# EAGLE design FXIMU (EAGLE 7.7.0)
COMPANY: ADAFRUIT INDUSTRIES; DRAWN: KTOWN; REV: A

## Sheet 1 of 2
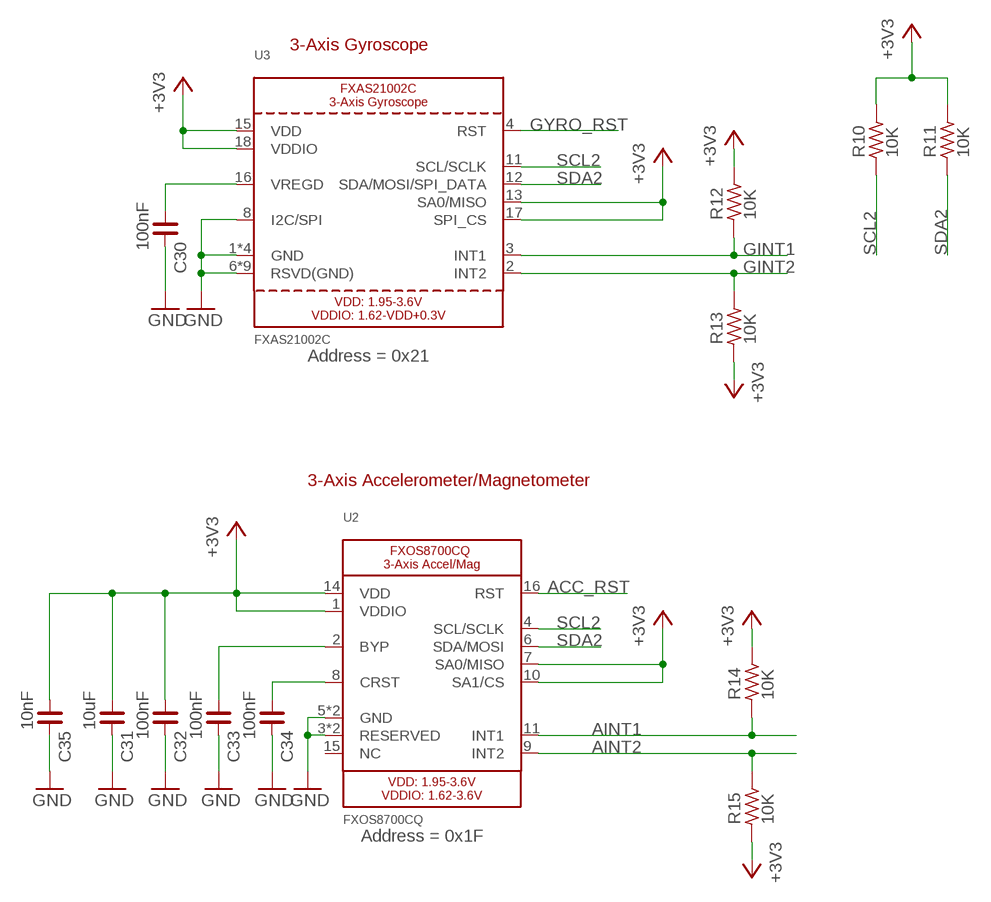
[diagram p0: schematic, sheet 1]

### Parts
C30  100nF  C_0402  [C0402]
C31  10uF  C_0603  [C0603]
C32  100nF  C_0402  [C0402]
C33  100nF  C_0402  [C0402]
C34  100nF  C_0402  [C0402]
C35  10nF  C_0402  [C0402]
R10  10K  R_0402  [R0402]
R11  10K  R_0402  [R0402]
R12  10K  R_0402  [R0402]
R13  10K  R_0402  [R0402]
R14  10K  R_0402  [R0402]
R15  10K  R_0402  [R0402]
U2  FXOS8700CQ  ACCEL_MAG_FXOS8700CQ  [QFN16_3MM_FREESCALE_5X3]
U3  FXAS21002C  GYRO_FXAS21002C  [QFN24_4MM_FREESCALE_7X5]

### Nets
+3V3: C31.1 C32.1 C35.1 R10.2 R11.2 R12.2 R13.1 R14.2 R15.1 U2.1(VDDIO) U2.7(SA0/MISO) U2.10(SA1/CS) U2.14(VDD) U3.13(SA0/MISO) U3.15(VDD) U3.17(SPI_CS) U3.18(VDDIO) ; also sheet 2
ACC_RST: U2.16(RST) ; also sheet 2
AINT1: R14.1 U2.11(INT1) ; also sheet 2
AINT2: R15.2 U2.9(INT2) ; also sheet 2
GINT1: R12.1 U3.3(INT1) ; also sheet 2
GINT2: R13.2 U3.2(INT2) ; also sheet 2
GND: C30.2 C31.2 C32.2 C33.2 C34.2 C35.2 U2.3(RESERVED) U2.5(GND) U2.12(GND) U2.13(RESERVED) U3.1(GND) U3.5(GND) U3.6(RSVD(GND)) U3.7(RSVD(GND)) U3.8(I2C/SPI) U3.9(RSVD(GND)) U3.10(RSVD(GND)) U3.14(GND) U3.19(GND) U3.20(RSVD(GND)) U3.21(RSVD(GND)) U3.22(RSVD(GND)) U3.23(RSVD(GND)) U3.24(RSVD(GND)) ; also sheet 2
GYRO_RST: U3.4(RST) ; also sheet 2
N$1: C30.1 U3.16(VREGD)
N$24: C33.1 U2.2(BYP)
N$26: C34.1 U2.8(CRST)
SCL2: R10.1 U2.4(SCL/SCLK) U3.11(SCL/SCLK) ; also sheet 2
SDA2: R11.1 U2.6(SDA/MOSI) U3.12(SDA/MOSI/SPI_DATA) ; also sheet 2
Unconnected: U2.15(NC)

### Notes on the sheet
- 3-Axis Gyroscope
- Address = 0x21
- 3-Axis Accelerometer/Magnetometer
- Address = 0x1F

## Sheet 2 of 2
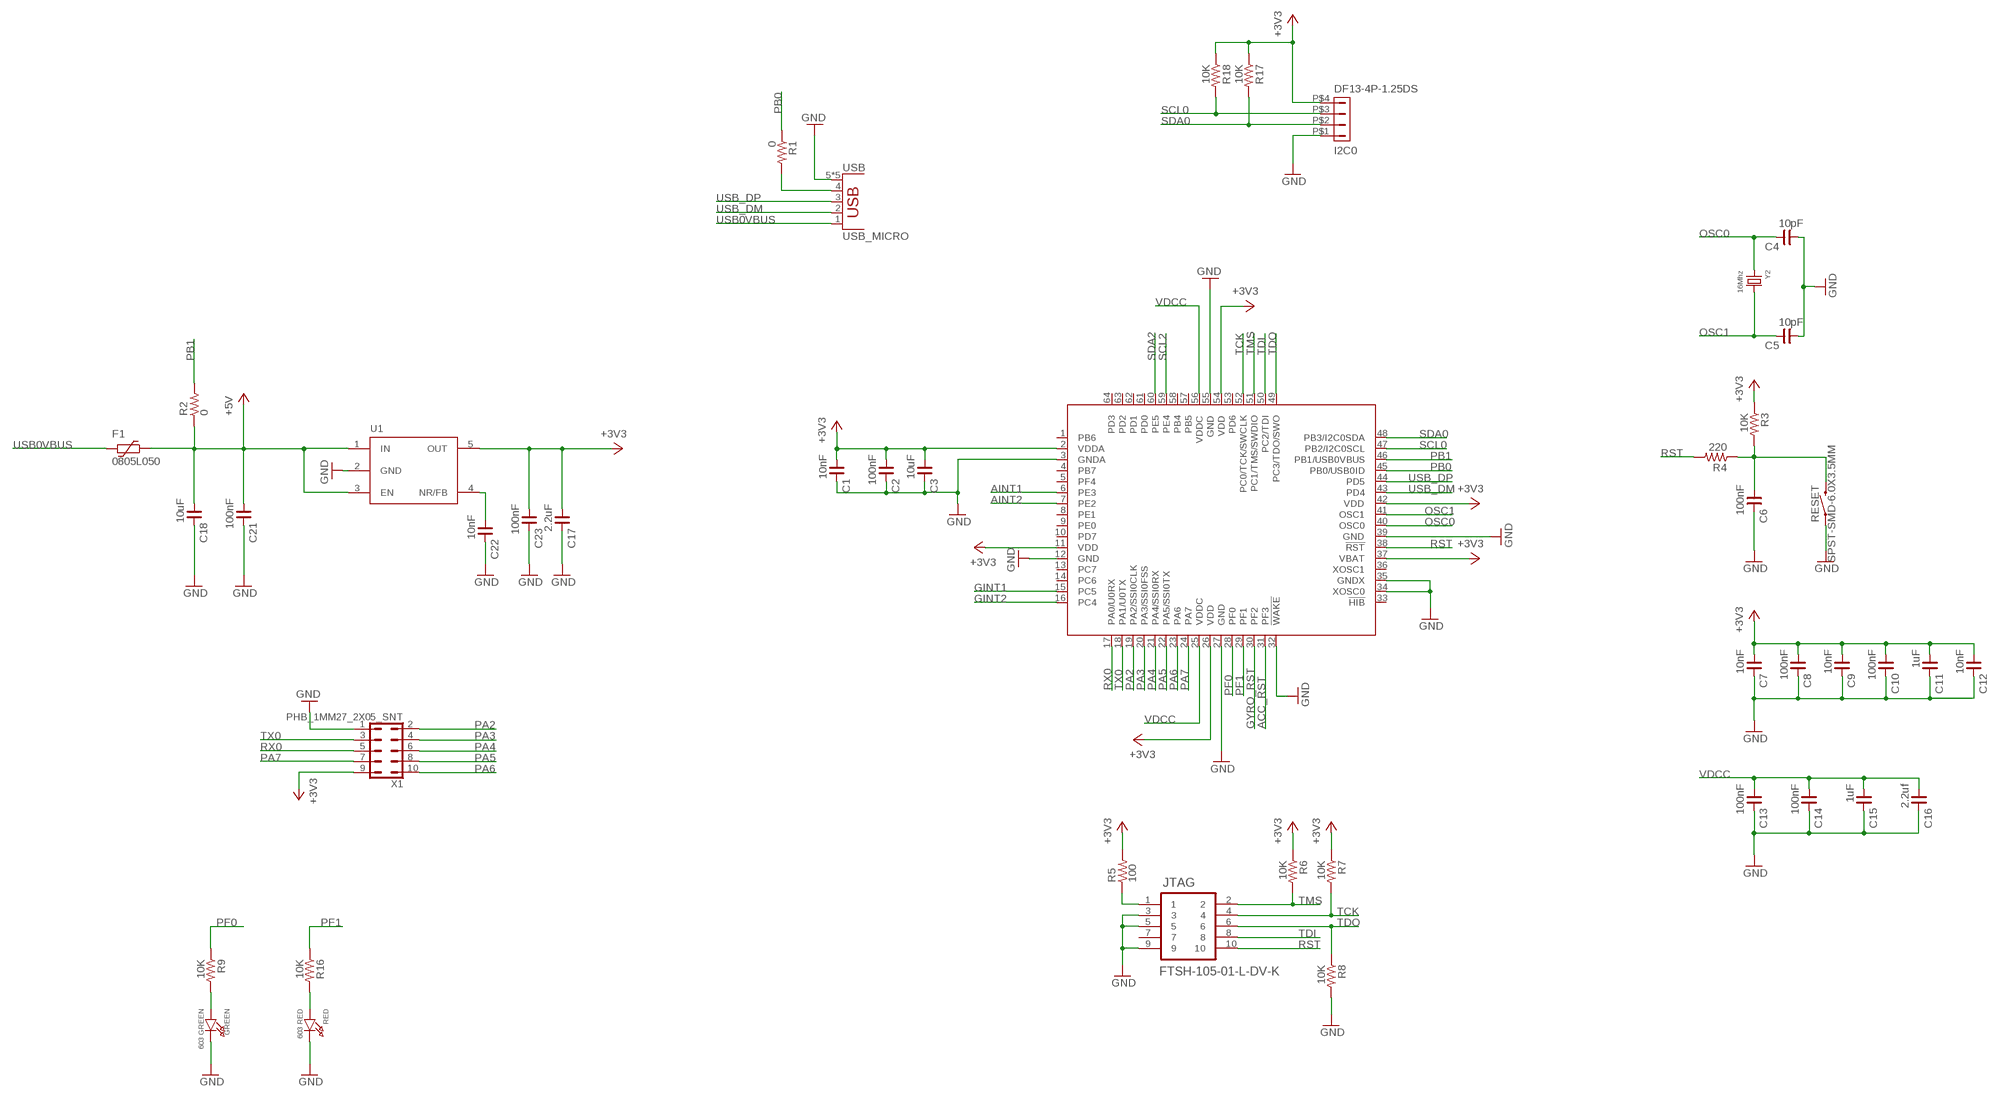
[diagram p1: schematic, sheet 2]

### Parts
C1  10nF  C_0402  [C0402]
C2  100nF  C_0402  [C0402]
C3  10uF  C_0603  [C0603]
C4  10pF  C_0402  [C0402]
C5  10pF  C_0402  [C0402]
C6  100nF  C_0402  [C0402]
C7  10nF  C_0402  [C0402]
C8  100nF  C_0402  [C0402]
C9  10nF  C_0402  [C0402]
C10  100nF  C_0402  [C0402]
C11  1uF  C_0402  [C0402]
C12  10nF  C_0402  [C0402]
C13  100nF  C_0402  [C0402]
C14  100nF  C_0402  [C0402]
C15  1uF  C_0402  [C0402]
C16  2.2uf  C_0603  [C0603]
C17  2.2uF  C_0603  [C0603]
C18  10uF  C_0603  [C0603]
C21  100nF  C_0402  [C0402]
C22  10nF  C_0402  [C0402]
C23  100nF  C_0402  [C0402]
F1  0805L050  [0805L]
GREEN  603 GREEN  LED0603  [CHIPLED_0603]
I2C0  DF13-4P-1.25DS  [DF13-4P-1.25DS]
IC1  TM4C123[7,G]XXPM  [PM_S-PQFP-G64]
JTAG  FTSH-105-01-L-DV-K  [SAMTEC_FTSH-105-01-L-DV-K]
R1  0  R_0402  [R0402]
R2  0  R_0402  [R0402]
R3  10K  R_0402  [R0402]
R4  220  R_0402  [R0402]
R5  100  R_0402  [R0402]
R6  10K  R_0402  [R0402]
R7  10K  R_0402  [R0402]
R8  10K  R_0402  [R0402]
R9  10K  R_0402  [R0402]
R16  10K  R_0402  [R0402]
R17  10K  R_0402  [R0402]
R18  10K  R_0402  [R0402]
RED  603 RED  LED0603  [CHIPLED_0603]
RESET  SPST-SMD-6.0X3.5MM  MOMENTARY-SWITCH-SPST-SMD-6.0X3.5MM  [TACTILE_SWITCH_SMD_6.0X3.5MM]
U1  TPS73633  [SOT23-5L]
USB  USB_MICRO  [USB_MICRO_MOLEX_FULL]
X1  PHB_1MM27_2X05_SNT  [PHB_1MM27_2X05_SNT]
Y2  16Mhz  CRYSTAL.6X3.3MM  [6X3.3MM]

### Nets
+3V3: C1.1 C2.1 C3.1 C7.1 C8.1 C9.1 C10.1 C11.1 C12.1 C17.1 C23.1 I2C0.P$4 IC1.2(VDDA) IC1.11(VDD) IC1.26(VDD) IC1.37(VBAT) IC1.42(VDD) IC1.54(VDD) R3.1 R5.2 R6.1 R7.1 R17.1 R18.1 U1.5(OUT) X1.9 ; also sheet 1
+5V: C18.1 C21.1 F1.1 R2.1 U1.1(IN) U1.3(EN)
ACC_RST: IC1.31(PF3) ; also sheet 1
AINT1: IC1.6(PE3) ; also sheet 1
AINT2: IC1.7(PE2) ; also sheet 1
GINT1: IC1.15(PC5) ; also sheet 1
GINT2: IC1.16(PC4) ; also sheet 1
GND: C1.2 C2.2 C3.2 C4.1 C5.1 C6.2 C7.2 C8.2 C9.2 C10.2 C11.2 C12.2 C13.2 C14.2 C15.2 C16.2 C17.2 C18.2 C21.2 C22.2 C23.2 GREEN.C I2C0.P$1 IC1.3(GNDA) IC1.12(GND) IC1.27(GND) IC1.32(!WAKE) IC1.34(XOSC0) IC1.35(GNDX) IC1.39(GND) IC1.55(GND) JTAG.3 JTAG.5 JTAG.9 R8.2 RED.C RESET.1 U1.2(GND) USB.5(GND) USB.P$1(GND) USB.P$2(GND) USB.P$3(GND) USB.P$4(GND) X1.1 ; also sheet 1
GYRO_RST: IC1.30(PF2) ; also sheet 1
N$2: JTAG.1 R5.1
N$4: C6.1 R3.2 R4.1 RESET.2
N$7: GREEN.A R9.2
N$8: R1.2 USB.4(ID)
N$9: R16.2 RED.A
N$17: C22.1 U1.4(NR/FB)
OSC0: C4.2 IC1.40(OSC0) Y2.1
OSC1: C5.2 IC1.41(OSC1) Y2.2
PA2: IC1.19(PA2/SSI0CLK) X1.2
PA3: IC1.20(PA3/SSI0FSS) X1.4
PA4: IC1.21(PA4/SSI0RX) X1.6
PA5: IC1.22(PA5/SSI0TX) X1.8
PA6: IC1.23(PA6) X1.10
PA7: IC1.24(PA7) X1.7
PB0: IC1.45(PB0/USB0ID) R1.1
PB1: IC1.46(PB1/USB0VBUS) R2.2
PF0: IC1.28(PF0) R9.1
PF1: IC1.29(PF1) R16.1
RST: IC1.38(!RST) JTAG.10 R4.2
RX0: IC1.17(PA0/U0RX) X1.5
SCL0: I2C0.P$3 IC1.47(PB2/I2C0SCL) R18.2
SCL2: IC1.59(PE4) ; also sheet 1
SDA0: I2C0.P$2 IC1.48(PB3/I2C0SDA) R17.2
SDA2: IC1.60(PE5) ; also sheet 1
TCK: IC1.52(PC0/TCK/SWCLK) JTAG.4 R7.2
TDI: IC1.50(PC2/TDI) JTAG.8
TDO: IC1.49(PC3/TDO/SWO) JTAG.6 R8.1
TMS: IC1.51(PC1/TMS/SWDIO) JTAG.2 R6.2
TX0: IC1.18(PA1/U0TX) X1.3
USB0VBUS: F1.2 USB.1(VBUS)
USB_DM: IC1.43(PD4) USB.2(D-)
USB_DP: IC1.44(PD5) USB.3(D+)
VDCC: C13.1 C14.1 C15.1 C16.1 IC1.25(VDDC) IC1.56(VDDC)
Unconnected: IC1.1(PB6) IC1.4(PB7) IC1.5(PF4) IC1.8(PE1) IC1.9(PE0) IC1.10(PD7) IC1.13(PC7) IC1.14(PC6) IC1.33(!HIB) IC1.36(XOSC1) IC1.53(PD6) IC1.57(PB5) IC1.58(PB4) IC1.61(PD0) IC1.62(PD1) IC1.63(PD2) IC1.64(PD3) JTAG.7

## Library data of the parts
C1-C18 C21-C23 C30-C35 = rc-master-smd:C_: NON-POLARIZED CAP
F1 = polyfuse-smd_10:?: Polyfuse Resettable PTC Source: http://www.littelfuse.com/products/resettable-ptcs.aspx; MF: Littelfuse; MPN: 0805L050; OC_FARNELL: 1832103; OC_NEWARK: 18M4776
GREEN RED = microbuilder:LED: LED 0603 - 0603 Surface Mount Package 2mA: Green LED - Low Power (3.9mcd, 2ma, 1.7Vf) - Digikey: 475-2709-2-ND Orange LED - Low Power (9.8mcd, 2ma, 1.8Vf) - Digikey: 475-1194-2-ND Red LED - Low Power (5mcd, 2ma, 1.8Vf) - Digikey: 475-1195-2-ND Yellow LED - Low Power (7mcd, 2ma, 1.8Vf) - Digikey: 475-1196-2-ND 5mA: Blue LED - Low Power (17mcd, 5ma, 2.9Vf) - Digikey: LNJ937W8CRACT-ND 0805 - 0805 Surface Mount Package 2mA: Red LED (8.8mcd, 2mA, 1.8Vf, Clear) - Low Power [Digikey: 475-2510-1-ND] Green LED (5mcd, 2mA, 1.8Vf, Clear) - Low Power [Digikey: 475-2730-1-ND] Yellow LED (11.3mcd, 2mA, 1.8Vf, Clear) - Low Power [Digikey: 475-2555-1-ND] 20mA: Red LED (104mcd, 20mA, Diffused) - LS R976 [Digikey: 475-1278-6-ND] Red LED (12mcd, 20mA, 2.0Vf, Clear) - APT2012EC [Digikey: 754-1128-1-ND] Green LED (15mcd, 20mA, 2.2Vf, Clear) - APT2012GC [Digikey: 754-1131-1-ND] Orange LED (160mcd, 20mA, 2.1Vf, Clear) - APT2012SECK [Digikey: 754-1130-1-ND] 1206 - 1206 Surface Mount Package Green LED (26mcd, 20mA, Diffused) - LG N971 [Digikey: 475-1407-6-ND] Red LED (15mcd, 20mA, Diffused) - LH N974 [Digikey: 475-1416-6-ND]
I2C0 = con-hirose-df13:DF13-4P-1.25: DF13-4P 1.25mm Pitch Miniature Crimping Connector.
IC1 = ti-tiva:TM4C123[7,G]XX
JTAG = FTSH-105-01-L-DV-K:FTSH-105-01-L-DV-K: CONN HEADER, 1.27MM, 2X5WAY, SMT; AVAILABILITY: Good; DESCRIPTION: Conn Unshrouded Header HDR 10 POS 1.27mm Solder ST SMD Automotive Tube; MF: Samtec; MP: FTSH-105-01-L-DV-K; PACKAGE: TSSOP-20 Texas Instruments; PRICE: 1.93 USD
R1-R18 = rc-master-smd:R_: RESISTOR
RESET = SparkFun-Switches:MOMENTARY-SWITCH-SPST: Momentary Switch (Pushbutton) - SPST Normally-open (NO) SPST momentary switches (buttons, pushbuttons). Variants PTH-12MM - 12mm square, through-hole Momentary Pushbutton Switch - 12mm Square <https://www.sparkfun.com/products/9190> (COM-09190) PTH-6.0MM, PTH-6.0MM-KIT - 6.0mm square, through-hole Mini Pushbutton Switch <https://www.sparkfun.com/products/97> (COM-00097) KIT package intended for soldering kit's - only one side of pads' copper is exposed. PTH-RIGHT-ANGLE-KIT - Right-angle, through-hole Right Angle Tactile Button <https://www.sparkfun.com/products/10791> - Used on SparkFun BigTime Watch Kit <https://www.sparkfun.com/products/11734> SMD-12MM - 12mm square, surface-mount Tactile Button - SMD (12mm) <https://www.sparkfun.com/products/12993> (COM-12993) Used on SparkFun PicoBoard <https://www.sparkfun.com/products/11888> SMD-4.5MM - 4.5mm Square Trackball Switch Used on SparkFun Blackberry Trackballer Breakout <https://www.sparkfun.com/products/13169> SMD-4.6MMX2.8MM - 4.60mm x 2.80mm, surface mount Used on SparkFun SAMD21 Mini Breakout <https://www.sparkfun.com/products/13664> SMD-5.2MM, SMD-5.2-REDUNDANT - 5.2mm square, surface-mount Mini Pushbutton Switch - SMD <https://www.sparkfun.com/products/8720> (COM-08720) Used on Arduino Pro Mini <https://www.sparkfun.com/products/11114> REDUNDANT package connects both switch circuits together SMD-6.0X3.5MM - 6.0 x 3.5mm, surface mount Momentary Reset Switch SMD <https://www.sparkfun.com/products/8229> (COM-08229) SMD-6.2MM-TALL - 6.2mm square, surface mount Tactile Button - SMD (6mm) <https://www.sparkfun.com/products/12992> Used on SparkFun Digital Sandbox <https://www.sparkfun.com/products/12651> SMD-RIGHT-ANGLE - Right-angle, surface mount Used on SparkFun Block for Intel® Edison - Arduino <https://www.sparkfun.com/products/13036>; PROD_ID: SWCH-00815; SF_SKU: COM-08229
U1 = tpslib:TPS73633
U2 = microbuilder:ACCEL_MAG_FXOS8700CQ: FX0S8700CQ - 3-Axis Accelerometer and Magnetometer Accel Range: +/-2/4/8 g Accel Data Rate: 1.6-800Hz (400Hz in hybrid mode) Accel Resolution: 14-bits Mag Range: 1200uT Mag Data Rate: 1.6-800Hz (400Hz in hybrid mode) Mag Resolution: 16-bits
U3 = microbuilder:GYRO_FXAS21002C: FXAS21002C - 3 Axis Gyroscope - 250/500/1000/2000dps Range: 250/500/1000/2000 dps Data Rate: 2.5-800Hz Resolution: 16-bits
USB = FLYTRON:USB_MICRO
X1 = _hhn_con_pinhead_box_1mm27:PHB_1MM27_2X05_*: Pin Header Box-Type, 1.27mm/0.5"/50mil Pitch, 2x05 Circuits Note: see library description for an important note about THT-version
Y2 = abracon:CRYSTAL

## Board
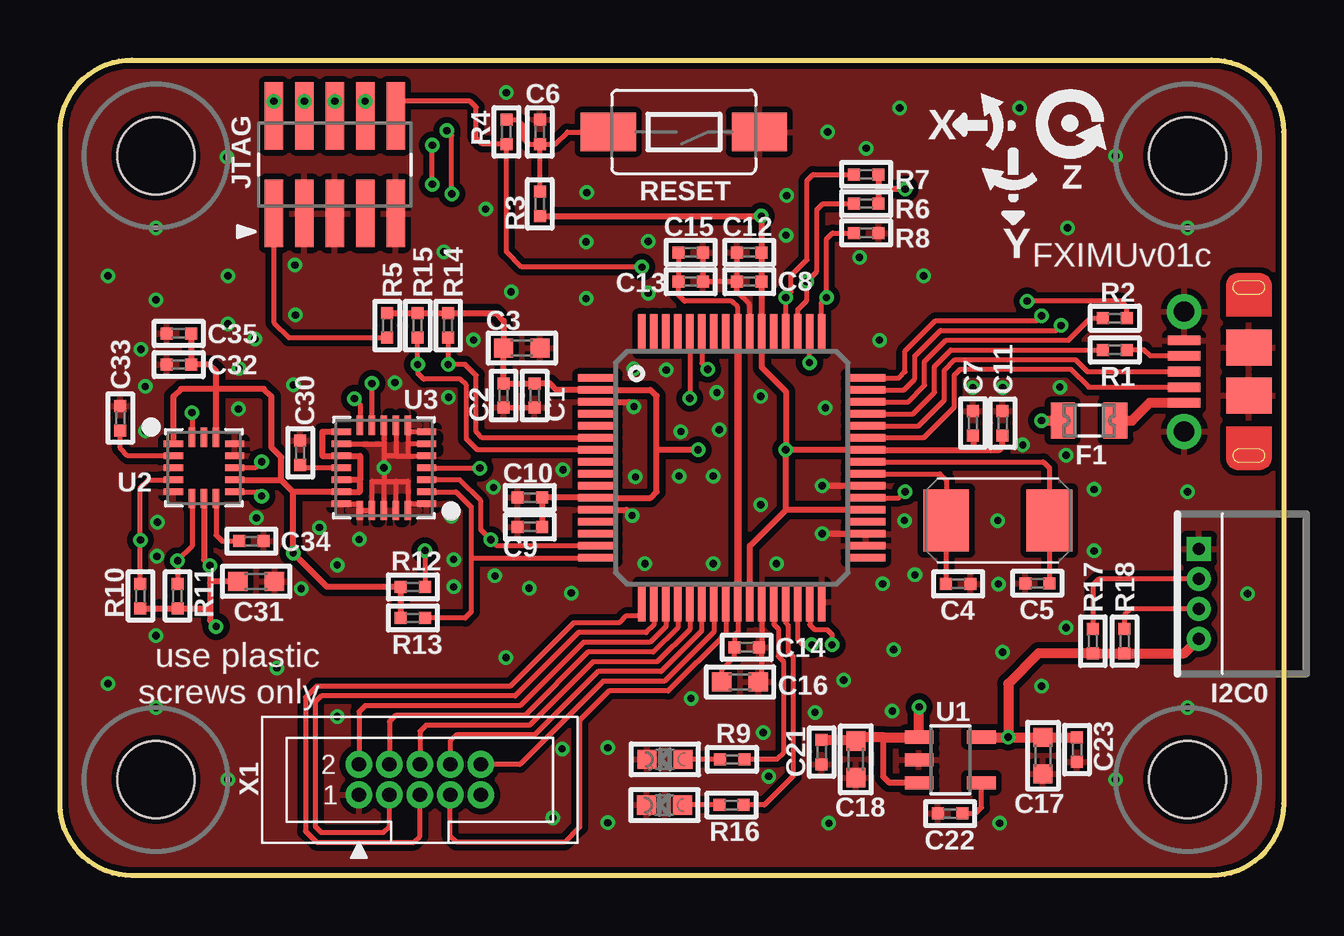
[diagram p2: board, top side]
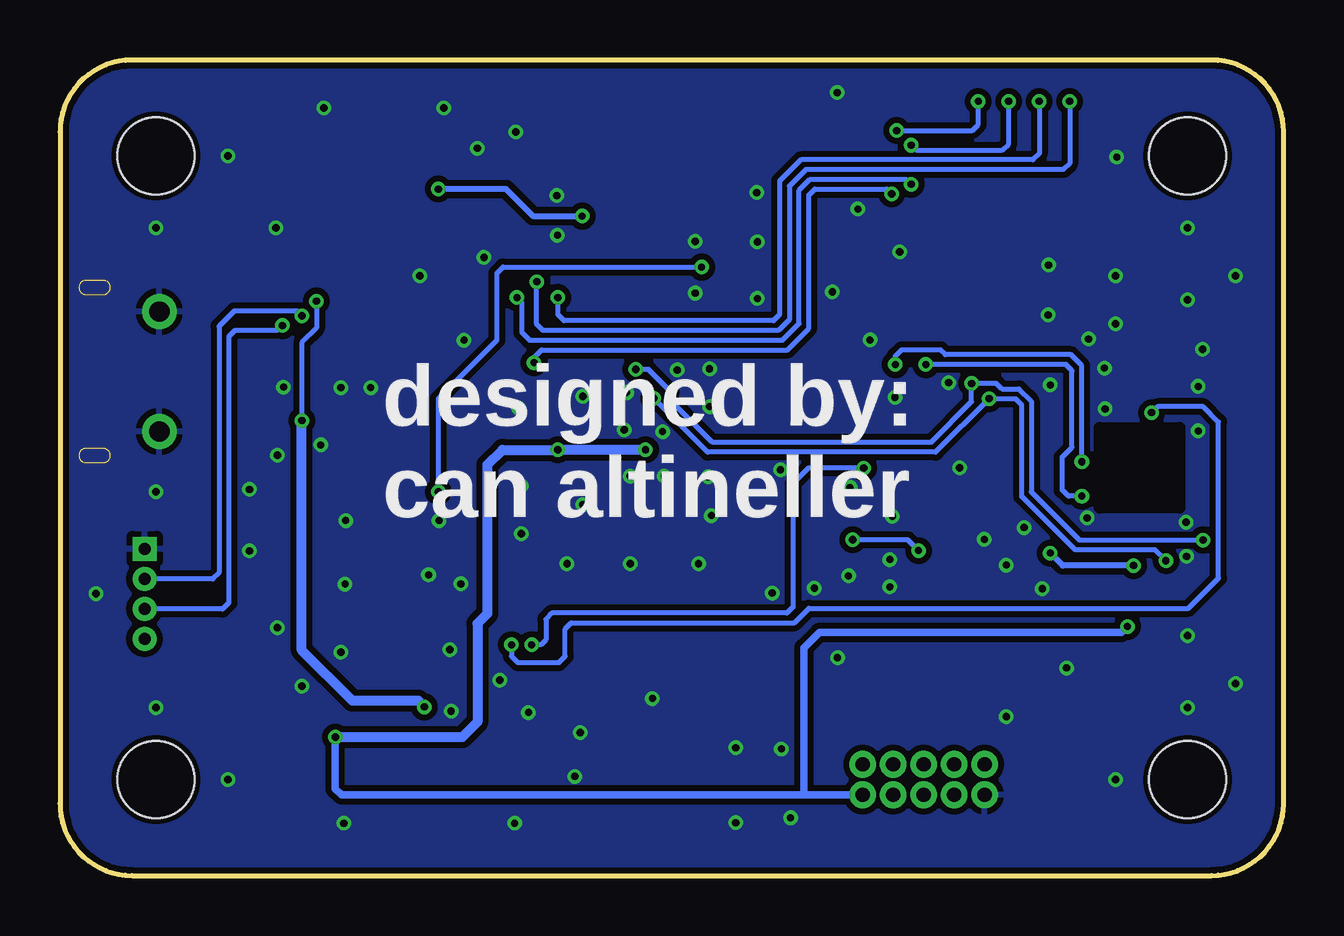
[diagram p3: board, bottom side, seen from below]

Size 51 x 34 mm. Coordinates in mm from the lower left corner, seen from the top.
Outline: 3,34 48,34 arc-90 51,31 51,3 arc-90 48,0 3,0 arc-90 0,3 0,31 arc-90 3,34
Copper layers (1*16): Top 0.035mm / dielectric 1.5mm / Bottom 0.035mm
Design rules "SeeedStudio_2layer_DRU_no_angle_20140221 *": minimum track width 6mil, minimum drill 11mil, track to track 6mil, track to pad 6mil, pad to pad 6mil, via to via 6mil, smd to smd 0mil, copper to edge 10mil, drill to drill 10mil, minimum pad ring 10mil, minimum via ring 6mil, stop-mask expansion 2mil, vias tented up to drill 12mil, thermal gap 10mil
Holes 3.2 mm at 4,30 4,4 47,4 47,30
tRestrict: area 13.7,18.3 to 13.8,19.2; area 14.2,18.3 to 14.3,19.2; area 14.8,18.2 to 15.7,18.3; area 14.8,17.7 to 15.7,17.8; area 13.2,14.8 to 13.3,15.7; area 14.2,14.8 to 14.3,15.7; area 5.3,16.3 to 6.7,17.7
bRestrict: area 4.3,15.3 to 7.7,18.7

### Footprints (pad centres in the part's own frame; a part is rotated, then mirrored left to right if it is on the bottom)
C0402 = smd 0.5 x 0.5: 1 -0.508,0; 2 0.508,0
C0603 = smd 0.8 x 0.8: 1 -0.762,0; 2 0.762,0
0805L = smd 1 x 1.5: 1 -1.1,0; 2 1.1,0
CHIPLED_0603 = smd 0.8 x 0.8: A 0,-0.75; C 0,0.75
DF13-4P-1.25DS = drill 0.5 pad 0.95 square: P$1 1.875,0 | drill 0.5 pad 0.95: P$2 0.625,0; P$3 -0.625,0; P$4 -1.875,0
PM_S-PQFP-G64 = smd 1.6 x 0.3: 1 -5.6,3.75; 2 -5.6,3.25; 3 -5.6,2.75; 4 -5.6,2.25; 5 -5.6,1.75; 6 -5.6,1.25; 7 -5.6,0.75; 8 -5.6,0.25; 9 -5.6,-0.25; 10 -5.6,-0.75; 11 -5.6,-1.25; 12 -5.6,-1.75; 13 -5.6,-2.25; 14 -5.6,-2.75; 15 -5.6,-3.25; 16 -5.6,-3.75; 33 5.6,-3.75; 34 5.6,-3.25; 35 5.6,-2.75; 36 5.6,-2.25; 37 5.6,-1.75; 38 5.6,-1.25; 39 5.6,-0.75; 40 5.6,-0.25; 41 5.6,0.25; 42 5.6,0.75; 43 5.6,1.25; 44 5.6,1.75; 45 5.6,2.25; 46 5.6,2.75; 47 5.6,3.25; 48 5.6,3.75 | smd 0.3 x 1.6: 17 -3.75,-5.6; 18 -3.25,-5.6; 19 -2.75,-5.6; 20 -2.25,-5.6; 21 -1.75,-5.6; 22 -1.25,-5.6; 23 -0.75,-5.6; 24 -0.25,-5.6; 25 0.25,-5.6; 26 0.75,-5.6; 27 1.25,-5.6; 28 1.75,-5.6; 29 2.25,-5.6; 30 2.75,-5.6; 31 3.25,-5.6; 32 3.75,-5.6; 49 3.75,5.6; 50 3.25,5.6; 51 2.75,5.6; 52 2.25,5.6; 53 1.75,5.6; 54 1.25,5.6; 55 0.75,5.6; 56 0.25,5.6; 57 -0.25,5.6; 58 -0.75,5.6; 59 -1.25,5.6; 60 -1.75,5.6; 61 -2.25,5.6; 62 -2.75,5.6; 63 -3.25,5.6; 64 -3.75,5.6
SAMTEC_FTSH-105-01-L-DV-K = smd 0.762 x 2.794: 1 -2.54,-2.032; 2 -2.54,2.032; 3 -1.27,-2.032; 4 -1.27,2.032; 5 0,-2.032; 6 0,2.032; 7 1.27,-2.032; 8 1.27,2.032; 9 2.54,-2.032; 10 2.54,2.032
R0402 = smd 0.5 x 0.5: 1 -0.508,0; 2 0.508,0
TACTILE_SWITCH_SMD_6.0X3.5MM = smd 2.3 x 1.6: 1 -3.15,0; 2 3.15,0
SOT23-5L = smd 0.55 x 1.2: 1 -0.95,-1.3; 2 0,-1.3; 3 0.95,-1.3; 4 0.95,1.3; 5 -0.95,1.3
QFN16_3MM_FREESCALE_5X3 = smd 0.8 x 0.275: 1 -1.275,1; 2 -1.275,0.5; 3 -1.275,0; 4 -1.275,-0.5; 5 -1.275,-1; 9 1.275,-1; 10 1.275,-0.5; 11 1.275,0; 12 1.275,0.5; 13 1.275,1 | smd 0.275 x 0.8: 6 -0.5,-1.275; 7 0,-1.275; 8 0.5,-1.275; 14 0.5,1.275; 15 0,1.275; 16 -0.5,1.275
QFN24_4MM_FREESCALE_7X5 = smd 0.8 x 0.275: 1 -1.775,1.5; 2 -1.775,1; 3 -1.775,0.5; 4 -1.775,0; 5 -1.775,-0.5; 6 -1.775,-1; 7 -1.775,-1.5; 13 1.775,-1.5; 14 1.775,-1; 15 1.775,-0.5; 16 1.775,0; 17 1.775,0.5; 18 1.775,1; 19 1.775,1.5 | smd 0.275 x 0.8: 8 -1,-1.775; 9 -0.5,-1.775; 10 0,-1.775; 11 0.5,-1.775; 12 1,-1.775; 20 1,1.775; 21 0.5,1.775; 22 0,1.775; 23 -0.5,1.775; 24 -1,1.775
USB_MICRO_MOLEX_FULL = smd 0.4 x 1.35: 1 -1.29,2.644; 2 -0.64,2.644; 3 0.01,2.644; 4 0.66,2.644; 5 1.31,2.644 | drill 0.85 pad 1.45: P$1 -2.49,2.644; P$2 2.51,2.644 | smd 1.5 x 1.9: P$3 1.01,-0.056; P$4 -0.99,-0.056
PHB_1MM27_2X05_SNT = drill 0.6 pad 0.95: 1 -2.54,-0.635; 2 -2.54,0.635; 3 -1.27,-0.635; 4 -1.27,0.635; 5 0,-0.635; 6 0,0.635; 7 1.27,-0.635; 8 1.27,0.635; 9 2.54,-0.635; 10 2.54,0.635
6X3.3MM = smd 1.9 x 2.6: 1 -2.15,0; 2 2.15,0

### Placement (x,y rotation side)
C1  19.79,20.01 270 top
C2  18.49,20.01 270 top
C3  19.25,21.99 0 top
C4  37.44,12.16 180 top
C5  40.74,12.19 0 top
C6  20,31 90 top
C7  38.05,18.86 90 top
C8  28.73,24.76 180 top
C9  19.58,14.53 180 top
C10  19.58,15.75 180 top
C11  39.29,18.86 90 top
C12  28.73,25.98 180 top
C13  26.29,24.76 0 top
C14  28.62,9.52 0 top
C15  26.29,25.98 0 top
C16  28.35,8.07 0 top
C17  40.97,5 270 top
C18  33.17,4.84 270 top
C21  31.75,5.15 270 top
C22  37.11,2.58 180 top
C23  42.39,5.25 270 top
C30  10.01,17.62 90 top
C31  8.18,12.26 0 top
C32  4.95,21.3 180 top
C33  2.51,19.07 90 top
C34  7.98,13.94 0 top
C35  4.95,22.6 180 top
F1  42.9,18.97 0 top
GREEN  25.22,4.84 90 top
I2C0  47.47,11.74 90 top
IC1  28,17 0 top
JTAG  11.45,29.64 0 top
R1  43.97,21.91 0 top
R2  43.97,23.23 180 top
R3  20,28 90 top
R4  18.61,31 270 top
R5  13.64,22.93 90 top
R6  33.6,28.01 180 top
R7  33.6,29.23 180 top
R8  33.6,26.79 0 top
R9  28.02,4.84 180 top
R10  3.35,11.65 270 top
R11  4.9,11.65 270 top
R12  14.71,12.03 180 top
R13  14.71,10.74 0 top
R14  16.18,22.93 90 top
R15  14.91,22.93 270 top
R16  27.99,2.94 180 top
R17  43.05,9.77 90 top
R18  44.37,9.77 90 top
RED  25.2,2.94 90 top
RESET  26,31 180 top
U1  37.11,4.82 270 top
U2  6,17 0 top
U3  13.5,17 180 top
U$27  [SYMBOL_GYRO_CCLOCKWISE]  37.18,30.03 0 top
U$28  [SYMBOL_GYRO_CLOCKWISE]  38.13,30.67 270 top
U$31  [SYMBOL_GYRO_Z]  40.67,29.89 0 top
USB  49.5,21 90 top
X1  15,4 0 top
Y2  39.09,14.8 0 top

### Tracks (layer width: path | path; a pad name or v marks a point on that pad's centre or on a via)
+3V3  (via drill 0.3)
  Top 0.203: 29.25,24.74 C8.1 | C7.1 38.07,18.35 | U2.14 | IC1.11 | U2.1 | 5.44,21.33 C32.1 | C17.1
  Top 0.254: C8.1 C12.1 v29.23,27.49 R3.1 | 29.25,24.74 IC1.54 29.25,21.19 30.25,20.18 v30.25,17.75 | 38.07,17.75 IC1.42 v30.25,17.75 | 38.07,17.75 39.16,17.75 39.29,17.88 C11.1 | 38.07,18.35 38.07,17.75 | R7.1 34.11,28.62 | 34.11,28.62 R6.1 | U3.13 10.93,18.5 10.93,17.5 U3.15 12.5,17.5 12.5,16.5 | 12.5,16.5 U3.17 | 12.5,16.5 12.5,16 U3.18 9.72,16 | IC1.26 28.75,13.75 30.25,15.25 | IC1.11 C10.1 C9.1 | IC1.37 30.25,15.25 | 30.25,15.25 v30.25,17.75 | U2.7 6,13.18 v6.25,12.92 6.25,12.21 | U2.10 9.22,16.5 | U2.14 6.5,20.29 | 9.22,16.5 9.72,16 | R10.2 R11.2 6.25,11.14 | 6.25,11.14 6.25,10.64 v6.51,10.38 | 6.5,20.29 6.5,21.05 6.25,21.3 C32.1 C35.1 | 9.22,16.5 9.22,17.44 8.81,17.85 8.81,19.97 8.49,20.29 6.5,20.29 | 6.5,20.29 5.04,20.29 4.72,19.97 U2.1 | 9.72,16 v9.72,13.44 11.13,12.03 R12.2 R13.1 | v35.23,28.62 34.11,28.62 | R5.2 R15.1 R14.2 18.17,23.44 18.49,23.12 C3.1 C2.1 C1.1 20.42,20.52 20.69,20.25 IC1.2 24.61,20.25 24.87,20 24.87,17.75 | IC1.11 24.61,15.75 24.87,16 24.87,17.75 | v26.59,17.75 24.87,17.75 | 6.25,12.21 6.25,11.14 | C31.1 6.3,12.26 6.25,12.21
  Top 0.406: U1.5 v39.52,5.77 | C17.1 41.16,5.77 C23.1 | v39.52,5.77 C17.1 | v39.52,5.77 39.52,7.99 40.79,9.26 R17.1 R18.1 46.87,9.26 I2C0.P$4
  Bottom 0.254: v6.25,12.92 9.2,12.92 v9.72,13.44 | v35.23,28.62 32.41,28.62 31.28,27.49 v29.23,27.49
  Bottom 0.305: X1.9 19.99,3.37 | 19.99,3.37 39.27,3.37 39.52,3.62 v39.52,5.77 | v6.51,10.38 6.76,10.13 19.35,10.13 19.99,9.49 19.99,3.37
  Bottom 0.406: v26.59,17.75 v30.25,17.75 32.56,17.75 33.2,17.12 33.2,10.91 33.6,10.51 33.6,6.4 34.24,5.77 v39.52,5.77
+5V  (via drill 0.3)
  Top 0.203: R2.1 44.47,23.69 44.22,23.95 v40.31,23.95
  Top 0.254: U1.3 34.57,3.87 34.31,4.12 34.31,5.77
  Top 0.406: v35.81,7.03 U1.1 34.31,5.77 33.33,5.77 C18.1 33.12,5.66 C21.1 | v40.92,18.97 F1.1
  Bottom 0.203: v40.31,23.95 40.31,22.83 40.92,22.22 v40.92,18.97
  Bottom 0.406: v40.92,18.97 40.92,9.39 38.81,7.28 36.06,7.28 v35.81,7.03
ACC_RST  (via drill 0.3)
  Top 0.203: v5.5,19.3 U2.16 | IC1.31 31.25,10.46 31.45,10.26 31.98,10.26 32.18,10.05 v32.18,9.62
  Bottom 0.203: v5.5,19.3 5.25,19.55 3.35,19.55 2.72,18.92 2.72,12.39 3.96,11.14 19.79,11.14 20.39,10.53 29.69,10.53 29.95,10.28 29.95,9.14 30.2,8.88 31.93,8.88 32.18,9.14 v32.18,9.62
AINT1  (via drill 0.3)
  Top 0.203: v8.41,17.25 8.15,17 U2.11 | IC1.6 17.6,18.25 17.35,18.5 17.35,20.85 16.89,21.3 v16.18,21.3 R14.1
  Bottom 0.203: v8.41,17.25 8.41,21.25 8.86,21.71 14.1,21.71 14.3,21.91 15.93,21.91 16.18,21.66 v16.18,21.3
AINT2  (via drill 0.3)
  Top 0.203: IC1.7 17.4,17.75 16.94,18.21 16.94,20.44 16.69,20.69 15.16,20.69 14.91,20.95 v14.91,21.3 R15.2 | U2.9 8.22,16 v8.41,15.82
  Bottom 0.203: v14.91,21.3 9.07,21.3 8.81,21.05 8.81,17.85 9.22,17.44 9.22,16.07 8.96,15.82 v8.41,15.82
GINT1  (via drill 0.3)
  Top 0.203: IC1.15 18.21,13.75 v17.96,14 17.55,14.41 17.55,15.61 16.66,16.5 U3.3 | v15.21,13.55 R12.1
  Bottom 0.203: v17.96,14 15.67,14 v15.21,13.55
GINT2
  Top 0.203: U3.2 16.51,16 17.14,15.37 17.14,13.25 | 17.14,13.25 IC1.16 | 17.14,13.25 17.14,10.99 16.89,10.74 R13.2
GND  (via drill 0.3)
  Top 0.203: C12.2 C8.2 | C15.2 C13.2 C8.2 | U3.14 13.5,18 | 14.5,18 U3.8 14.5,18.5 U3.7 | 14.5,17.5 U3.5 | U3.6 14.5,18 | 14.5,18 14.5,17.5 | U3.9 14,17.5 | U3.10 13.5,18 | 13.5,16.43 13,16.43 U3.21 U3.20 12.5,15.5 U3.19 | 13.52,16.43 14,16.43 | 14,16.43 14.5,16.43 U3.24 14.5,15.5 U3.1 | U3.22 13.52,15.22 13.52,16.43 | U3.23 14,16.43 | 13.5,18 13.5,17.44 | 13.5,17.44 13.5,16.43 | 13.5,16.43 13.52,16.43 | 14,17.5 13.56,17.5 arc90 13.5,17.44 | 14,17.5 14.5,17.5 | C2.2 C1.2 | IC1.27 29.25,9.64 C14.2 29.26,9.39 29.26,8.22 C16.2 | IC1.55 28.75,23.8 28.22,24.33 C8.2
  Top 0.254: IC1.3 23.73,19.75 v23.93,19.55 | IC1.12 23.6,15.25 v23.85,15.01 | IC1.39 v31.77,16.25 | IC1.35 v31.77,14.25
  other vias: 13.5,17 8.19,14.91 3.55,18.54 7.44,19.45 4.06,14.73 4.04,13.3 18.07,16.18 16.19,19.94 17.23,22.33 18.81,24.33 9.82,23.37 17.74,27.79 21.93,26.41 21.96,28.47 24.52,26.44 21.93,24.05 30.29,28.35 39.09,14.8 43.1,16.1 43.1,13.53 41.93,17.52 34.29,12.16 21.31,11.78 19.56,11.98 18.13,12.49 16.41,12.03 16.41,13.18 11.56,12.95 16.31,14.98 18.59,9.09 34.7,6.85 31.47,6.8 34.16,22.32 33.32,25.77 33.6,30.32 9.79,25.45 13.96,20.55 22.83,5.33 22.83,2.2 29.54,4.13 29.31,5.96 40.92,7.89 39.29,9.32 41.93,10.33 7,4 4,7 47,7 44,4 7,23 7.47,21.15 8.13,22.37 3.38,21.94 3.55,20.39 27.23,13 29.87,13 24.38,13 25.81,16.66 27.23,16.66 29.21,15.46 29.21,19.98 31.9,19.5 27.48,18.59 23.93,21.13 25.27,21.08 27.38,20.14 25.88,18.51 32.66,8.15 35.2,14.8 47,16 4,27 6.95,29.95 47,27 44,30 39.12,12.15 35.64,12.53 30.26,26.69 18.61,32.64 4,24 4,10 2,8 2,25 16,26 7,25 36,25 32,31 35,32 42,27 9.72,20.45 10.81,14.51 10.06,11.96 9.04,8.65 32.05,2.18 23.99,16.62 39.16,2.18 40,32 26.31,7.38 49.5,11.75 11.56,6.62 20.55,2.41 20.93,5.28 39.29,20.34 34.75,9.42 38.05,20.34 40.13,17.95 41.68,20.36 20.97,16.92 12.47,14.01 24.52,24.28
  pour Bottom (isolate 0.254): 51,3 51,31 arc90 48,34 3,34 arc90 0,31 0,3 arc90 3,0 48,0 arc90
  pour Top (isolate 0.254): 51,3 51,31 arc90 48,34 3,34 arc90 0,31 0,3 arc90 3,0 48,0 arc90
GYRO_RST  (via drill 0.3)
  Top 0.203: IC1.30 30.75,9.82 30.95,9.62 v31.34,9.62 | U3.4 15.29,16.99 v17.5,16.99
  Bottom 0.203: v31.34,9.62 30.95,9.62 30.75,9.82 30.75,10.7 30.5,10.94 20.7,10.94 20.45,11.2 20.45,15.79 20.45,16.02 20.45,16.35 19.81,16.99 v17.5,16.99
N$1
  Top 0.203: U3.16 10.13,17 arc-90 C30.1
N$2
  Top 0.203: JTAG.1 8.91,23.06 9.55,22.42 R5.1
N$4
  Top 0.203: C6.1 20.64,30.49 21.15,31 RESET.2 | R4.1 19.05,31.51 19.3,31.25 19.3,30.75 19.56,30.49 C6.1 | R3.2 C6.1
N$7
  Top 0.203: R9.2 GREEN.A
N$8
  Top 0.203: USB.4 45.44,21.66 45.19,21.91 R1.2
N$9
  Top 0.203: R16.2 RED.A
N$17
  Top 0.203: C22.1 38.15,2.58 38.41,2.84 U1.4
N$24
  Top 0.203: U2.2 2.83,17.5 2.51,17.82 C33.1
N$26
  Top 0.203: U2.8 6.5,14.19 6.75,13.94 C34.1
OSC0
  Top 0.203: IC1.40 36.69,16.75 36.94,16.5 Y2.1 C4.2
OSC1
  Top 0.203: IC1.41 40.99,17.25 41.24,17 Y2.2 C5.2
PA2
  Top 0.203: IC1.19 25.25,10.38 24.59,9.72 21.82,9.72 19.18,7.08 12.71,7.08 12.46,6.83 X1.2
PA3
  Top 0.203: IC1.20 25.75,10.33 24.74,9.32 22.02,9.32 19.38,6.67 13.98,6.67 13.73,6.42 X1.4
PA4
  Top 0.203: IC1.21 26.25,10.27 24.89,8.91 22.22,8.91 19.58,6.27 15.25,6.27 15,6.01 X1.6
PA5
  Top 0.203: IC1.22 26.75,10.21 25.04,8.5 22.43,8.5 19.79,5.86 16.52,5.86 16.27,5.61 X1.8
PA6
  Top 0.203: IC1.23 27.25,10.15 25.2,8.1 22.63,8.1 19.17,4.63 X1.10
PA7
  Top 0.203: IC1.24 27.75,10.09 25.35,7.69 22.88,7.69 21.66,6.47 21.66,2.02 21.03,1.39 16.52,1.39 16.27,1.64 X1.7
PB0
  Top 0.203: IC1.45 35.56,19.25 36.45,20.14 36.45,21.23 37.13,21.91 R1.1
PB1
  Top 0.203: IC1.46 35.36,19.75 36.04,20.44 36.04,21.43 36.93,22.32 42.04,22.32 42.95,23.23 R2.2
PF0
  Top 0.203: IC1.28 29.75,10.48 29.95,10.28 29.95,9.14 30.15,8.93 30.15,5.1 29.89,4.85 R9.1
PF1
  Top 0.203: IC1.29 30.25,10.54 30.35,10.43 30.35,9.34 30.55,9.14 30.55,4.13 29.36,2.94 R16.1
RST  (via drill 0.3)
  Top 0.203: IC1.38 34.98,15.75 v35.23,16 | v24.26,25.37 19.24,25.37 18.61,26 R4.2 17.6,30.49 17.35,30.75 17.35,32.02 17.09,32.28 14.1,32.28 14.1,31.77 JTAG.10
  Bottom 0.203: v35.23,16 35.23,19.88 32.79,22.32 32.79,25.11 32.54,25.37 v24.26,25.37
RX0
  Top 0.203: X1.5 15,1.64 14.75,1.39 10.69,1.39 10.23,1.85 10.23,7.44 10.69,7.89 18.77,7.89 21.41,10.53 23.32,10.53 23.62,10.84 24.25,10.84 IC1.17
SCL0  (via drill 0.3)
  Top 0.203: IC1.47 35.18,20.25 35.64,20.71 35.64,21.66 36.7,22.73 41.53,22.73 v41.73,22.93 | I2C0.P$3 44.63,11.11 44.37,10.86 R18.2
  Bottom 0.203: v41.73,22.93 41.93,22.73 43.71,22.73 43.97,22.47 43.97,11.37 44.22,11.11 I2C0.P$3
SCL2  (via drill 0.3)
  Top 0.203: IC1.59 26.75,21.35 v27,21.1 | U2.4 3.67,16.5 3.35,16.18 v3.35,13.99 R10.1 | U3.11 v13,20.52
  Bottom 0.203: v27,21.1 26.47,21.1 25.53,20.16 25.53,19.78 23.8,18.05 14.71,18.05 13,19.75 v13,20.52 11.96,20.52 11.73,20.29 11.02,20.29 10.52,19.78 10.52,15.99 8.51,13.99 v3.35,13.99
SDA0  (via drill 0.3)
  Top 0.203: IC1.48 34.98,20.75 35.23,21 35.23,21.86 36.5,23.13 40.72,23.13 v40.92,23.34 | I2C0.P$2 43.31,12.36 43.05,12.11 R17.2
  Bottom 0.203: v40.92,23.34 41.12,23.54 43.74,23.54 44.37,22.9 44.37,12.62 44.63,12.36 I2C0.P$2
SDA2  (via drill 0.3)
  Top 0.203: IC1.60 v26.25,19.89 | v12.27,19.88 12.5,19.65 U3.12 | U2.6 5.5,13.72 v4.9,13.12 R11.1
  Bottom 0.203: v26.25,19.89 24,17.65 14.5,17.65 v12.27,19.88 11.18,19.88 10.92,19.63 10.92,15.82 8.69,13.58 5.36,13.58 v4.9,13.12
TCK  (via drill 0.3)
  Top 0.203: IC1.52 | IC1.52 v30.25,24.1 30.48,24.33 30.48,25.01 31.14,25.67 31.14,28.98 31.39,29.23 R7.2 | v10.18,32.28 10.2,32.27 JTAG.4
  Bottom 0.203: v30.25,24.1 30.25,23.39 30,23.13 21.26,23.13 21.01,23.39 21.01,28.95 20.12,29.84 10.44,29.84 10.18,30.09 v10.18,32.28
TDI  (via drill 0.3)
  Top 0.203: v31.24,21.38 IC1.50 | v16.33,28.42 16.33,30.85 v16.13,31.06 | v12.72,32.28 JTAG.8
  Bottom 0.203: v31.24,21.38 31.24,21.6 30.92,21.91 20.68,21.91 19.79,22.8 19.79,28.36 19.53,28.62 16.53,28.62 v16.33,28.42 | v16.13,31.06 12.98,31.06 12.72,31.31 v12.72,32.28
TDO  (via drill 0.3)
  Top 0.203: IC1.49 31.75,23.89 v31.95,24.1 31.95,26.54 32.21,26.79 R8.1 | v15.52,28.82 v15.52,30.45 | v11.45,32.28 JTAG.6
  Bottom 0.203: v31.95,24.1 31.75,23.89 31.75,22.64 31.43,22.32 20.88,22.32 20.19,23.01 20.19,28.57 19.73,29.03 15.72,29.03 v15.52,28.82 | v15.52,30.45 15.32,30.25 11.71,30.25 11.45,30.5 v11.45,32.28
TMS  (via drill 0.3)
  Top 0.203: IC1.51 30.75,23.59 31.13,23.97 v31.13,24.76 31.55,25.18 31.55,27.76 31.8,28.01 R6.2 | JTAG.2 v8.91,32.28
  Bottom 0.203: v31.13,24.76 31.13,22.98 30.87,22.73 21.06,22.73 20.6,23.18 20.6,28.75 19.91,29.43 9.17,29.43 8.91,29.69 v8.91,32.28
TX0
  Top 0.203: IC1.18 24.75,10.45 24.43,10.13 21.61,10.13 18.97,7.49 10.9,7.49 10.64,7.23 10.64,2.05 10.9,1.8 13.48,1.8 13.73,2.05 X1.3
USB0VBUS
  Top 0.406: F1.2 44.68,18.97 45.42,19.71 USB.1
USB_DM
  Top 0.203: USB.2 42.88,20.36 42.14,21.1 37.52,21.1 37.26,20.85 37.26,19.52 35.99,18.25 IC1.43
USB_DP
  Top 0.203: USB.3 42.82,21.01 42.33,21.51 37.31,21.51 36.85,21.05 36.85,19.82 35.79,18.75 IC1.44
VDCC
  Top 0.203: C15.1 C13.1 25.78,24.2 26.03,23.95 28,23.95 28.25,23.69 IC1.56 | 28.25,9.65 C14.1 | C16.1 27.58,8.58 28.12,9.11 C14.1 | IC1.25 28.25,10.16 28.12,10.03 C14.1
  Top 0.305: IC1.56 IC1.25

### Text on the board
tPlace: X | Z | Y
tNames: FXIMUv01c | use plastic / screws only
bNames: designed by: / can altineller